# Altium schematic sheet Control.SchDoc
size A4; SheetNumber: 1; SheetTotal: 5
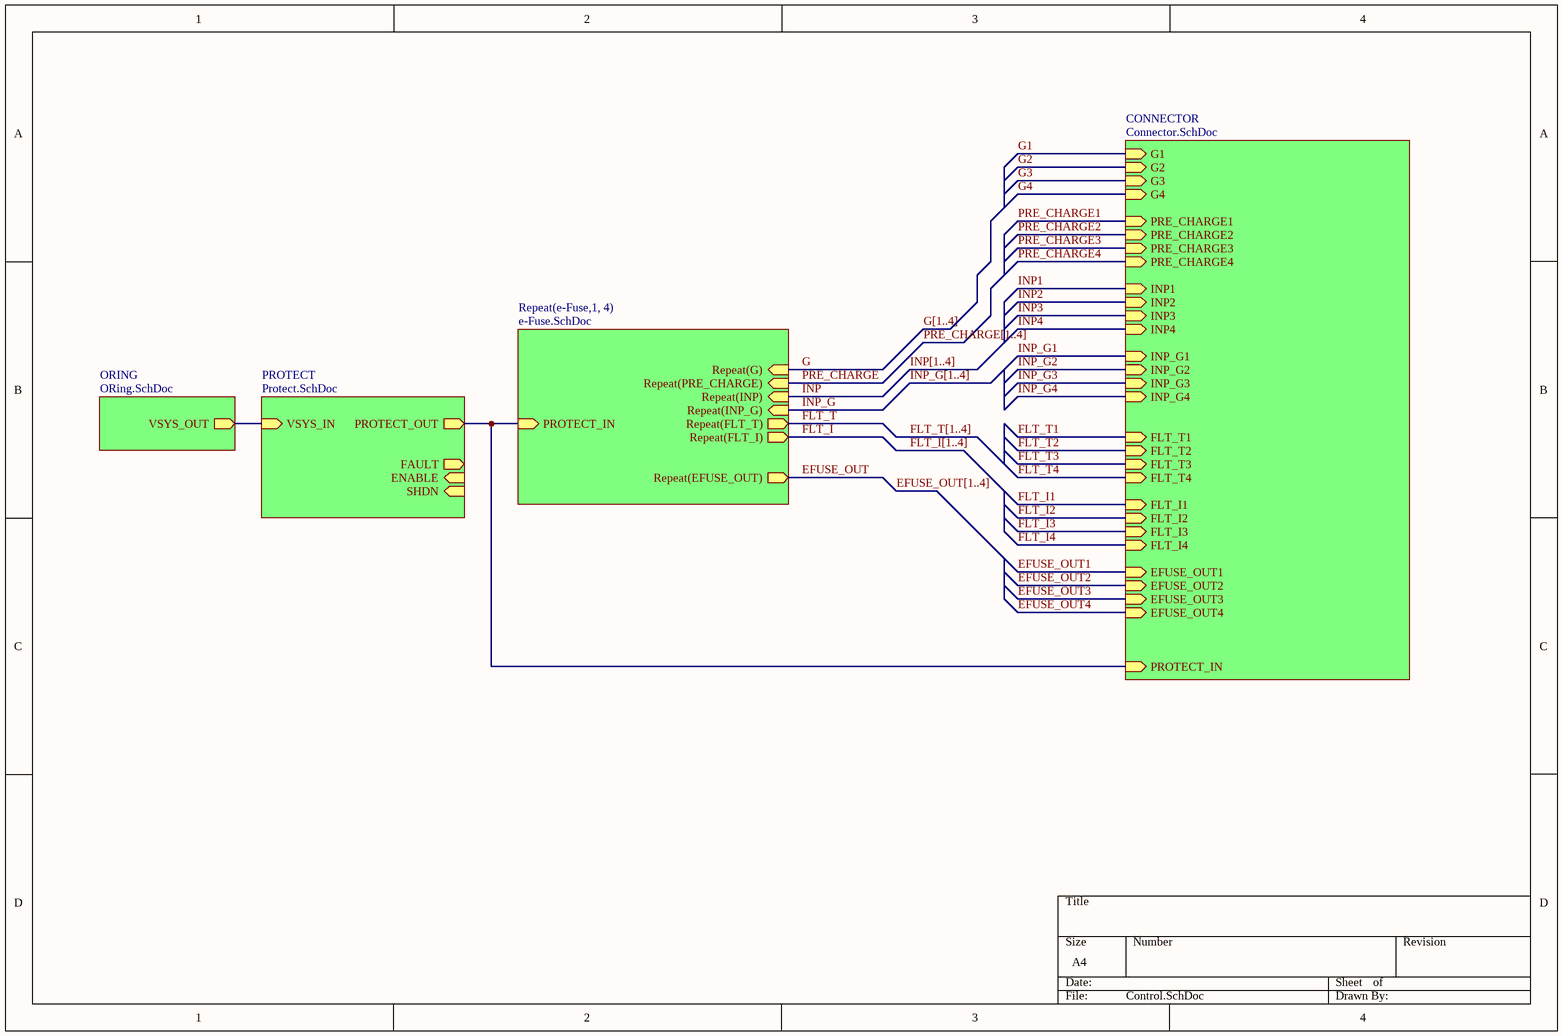
[diagram p0: Control.SchDoc]

## Sub-sheets
CONNECTOR = Connector.SchDoc: FLT_I4 (in), FLT_T4 (in), INP_G4 (in), INP4 (in), FLT_I3 (in), FLT_T3 (in), INP_G3 (in), INP3 (in), FLT_I2 (in), FLT_T2 (in), INP_G2 (in), INP2 (in), FLT_I1 (in), FLT_T1 (in), INP_G1 (in), INP1 (in), PROTECT_IN (in), EFUSE_OUT4 (in), EFUSE_OUT3 (in), EFUSE_OUT2 (in), EFUSE_OUT1 (in), PRE_CHARGE4 (in), G4 (in), G3 (in), PRE_CHARGE2 (in), G2 (in), PRE_CHARGE1 (in), G1 (in), PRE_CHARGE3 (in)
ORING = ORing.SchDoc: VSYS_OUT (out)
PROTECT = Protect.SchDoc: PROTECT_OUT (out), VSYS_IN (in), SHDN (in), ENABLE (in), FAULT (out)
Repeat(e-Fuse,1, 4) = e-Fuse.SchDoc: PROTECT_IN (in), Repeat(PRE_CHARGE) (in), Repeat(EFUSE_OUT) (out), Repeat(G) (in), Repeat(FLT_I) (out), Repeat(FLT_T) (out), Repeat(INP_G) (in), Repeat(INP) (in)

## Nets
EFUSE_OUT: sheet Repeat(e-Fuse,1, 4)/Repeat(EFUSE_OUT)
EFUSE_OUT1: sheet CONNECTOR/EFUSE_OUT1
EFUSE_OUT2: sheet CONNECTOR/EFUSE_OUT2
EFUSE_OUT3: sheet CONNECTOR/EFUSE_OUT3
EFUSE_OUT4: sheet CONNECTOR/EFUSE_OUT4
FLT_I: sheet Repeat(e-Fuse,1, 4)/Repeat(FLT_I)
FLT_I1: sheet CONNECTOR/FLT_I1
FLT_I2: sheet CONNECTOR/FLT_I2
FLT_I3: sheet CONNECTOR/FLT_I3
FLT_I4: sheet CONNECTOR/FLT_I4
FLT_T: sheet Repeat(e-Fuse,1, 4)/Repeat(FLT_T)
FLT_T1: sheet CONNECTOR/FLT_T1
FLT_T2: sheet CONNECTOR/FLT_T2
FLT_T3: sheet CONNECTOR/FLT_T3
FLT_T4: sheet CONNECTOR/FLT_T4
G: sheet Repeat(e-Fuse,1, 4)/Repeat(G)
G1: sheet CONNECTOR/G1
G2: sheet CONNECTOR/G2
G3: sheet CONNECTOR/G3
G4: sheet CONNECTOR/G4
INP: sheet Repeat(e-Fuse,1, 4)/Repeat(INP)
INP1: sheet CONNECTOR/INP1
INP2: sheet CONNECTOR/INP2
INP3: sheet CONNECTOR/INP3
INP4: sheet CONNECTOR/INP4
INP_G: sheet Repeat(e-Fuse,1, 4)/Repeat(INP_G)
INP_G1: sheet CONNECTOR/INP_G1
INP_G2: sheet CONNECTOR/INP_G2
INP_G3: sheet CONNECTOR/INP_G3
INP_G4: sheet CONNECTOR/INP_G4
PRE_CHARGE: sheet Repeat(e-Fuse,1, 4)/Repeat(PRE_CHARGE)
PRE_CHARGE1: sheet CONNECTOR/PRE_CHARGE1
PRE_CHARGE2: sheet CONNECTOR/PRE_CHARGE2
PRE_CHARGE3: sheet CONNECTOR/PRE_CHARGE3
PRE_CHARGE4: sheet CONNECTOR/PRE_CHARGE4
(unnamed): sheet PROTECT/PROTECT_OUT, sheet Repeat(e-Fuse,1, 4)/PROTECT_IN, sheet CONNECTOR/PROTECT_IN
(unnamed): sheet PROTECT/VSYS_IN, sheet ORING/VSYS_OUT

## Buses and harness runs
bus EFUSE_OUT[1..4]
bus FLT_I[1..4]
bus FLT_T[1..4]
bus G[1..4]
bus INP[1..4]
bus INP_G[1..4]
bus PRE_CHARGE[1..4]